# EAGLE design funnel (EAGLE 4.16)
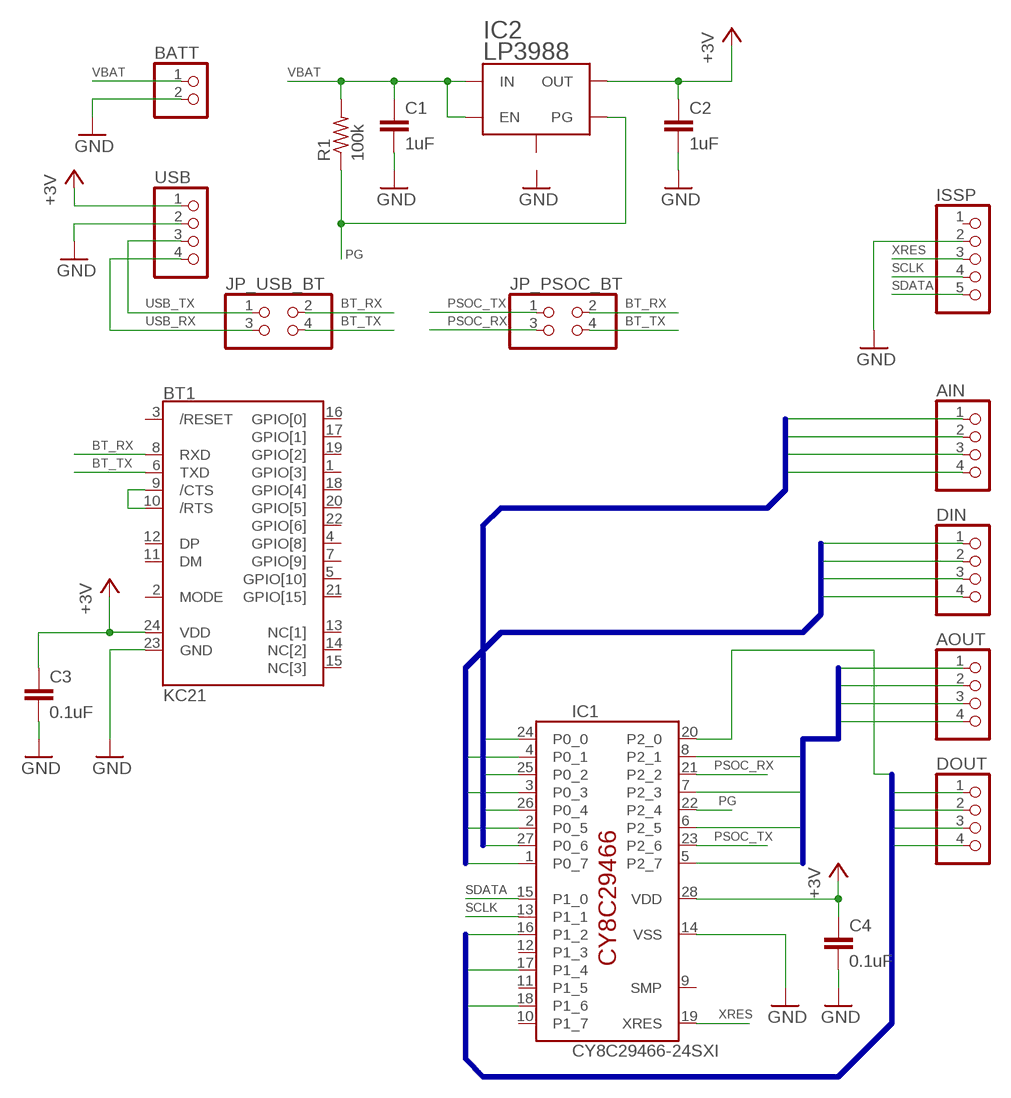
[diagram p0: schematic, sheet 1]

## Parts
AIN  PINHD-1X4  [1X04]
AOUT  PINHD-1X4  [1X04]
BATT  PINHD-1X2  [1X02]
BT1  KC21  [KC21]
C1  1uF  C-EUC3216  [C3216]
C2  1uF  C-EUC3216  [C3216]
C3  0.1uF  C-EUC2012  [C2012]
C4  0.1uF  C-EUC2012  [C2012]
DIN  PINHD-1X4  [1X04]
DOUT  PINHD-1X4  [1X04]
IC1  CY8C29466-24SXI  [SOIC28]
IC2  LP3988  [SOT-23-5]
ISSP  PINHD-1X5  [1X05]
JP_PSOC_BT  PINHD-2X2  [2X02]
JP_USB_BT  PINHD-2X2  [2X02]
R1  100k  R-US_R2012  [R2012]
USB  PINHD-1X4  [1X04]

## Nets
+3V: BT1.24(VDD) C2.1 C3.1 C4.1 IC1.28(VDD) IC2.P$5(OUT) USB.1
AIN0: AIN.1 IC1.27(P0_6)
AIN1: AIN.2 IC1.26(P0_4)
AIN2: AIN.3 IC1.25(P0_2)
AIN3: AIN.4 IC1.24(P0_0)
AOUT0: AOUT.1 IC1.5(P2_7)
AOUT1: AOUT.2 IC1.6(P2_5)
AOUT2: AOUT.3 IC1.7(P2_3)
AOUT3: AOUT.4 IC1.8(P2_1)
BT_RX: BT1.8(RXD) JP_PSOC_BT.2 JP_USB_BT.2
BT_TX: BT1.6(TXD) JP_PSOC_BT.4 JP_USB_BT.4
DIN0: DIN.1 IC1.1(P0_7)
DIN1: DIN.2 IC1.2(P0_5)
DIN2: DIN.3 IC1.3(P0_3)
DIN3: DIN.4 IC1.4(P0_1)
DOUT0: DOUT.1 IC1.18(P1_6)
DOUT1: DOUT.2 IC1.17(P1_4)
DOUT2: DOUT.3 IC1.16(P1_2)
DOUT3: DOUT.4 IC1.20(P2_0)
GND: BATT.2 BT1.23(GND) C1.2 C2.2 C3.2 C4.2 IC1.14(VSS) ISSP.2 USB.2
N$1: BT1.9(/CTS) BT1.10(/RTS)
PG: IC1.22(P2_4) IC2.P$4(PG) R1.1
PSOC_RX: IC1.21(P2_2) JP_PSOC_BT.3
PSOC_TX: IC1.23(P2_6) JP_PSOC_BT.1
SCLK: IC1.13(P1_1) ISSP.4
SDATA: IC1.15(P1_0) ISSP.5
USB_RX: JP_USB_BT.3 USB.4
USB_TX: JP_USB_BT.1 USB.3
VBAT: BATT.1 C1.1 IC2.P$1(IN) IC2.P$3(EN) R1.2
XRES: IC1.19(XRES) ISSP.3
Unconnected: BT1.1(GPIO[3]) BT1.2(MODE) BT1.3(/RESET) BT1.4(GPIO[8]) BT1.5(GPIO[10]) BT1.7(GPIO[9]) BT1.11(DM) BT1.12(DP) BT1.13(NC[1]) BT1.14(NC[2]) BT1.15(NC[3]) BT1.16(GPIO[0]) BT1.17(GPIO[1]) BT1.18(GPIO[4]) BT1.19(GPIO[2]) BT1.20(GPIO[5]) BT1.21(GPIO[15]) BT1.22(GPIO[6]) IC1.9(SMP) IC1.10(P1_7) IC1.11(P1_5) IC1.12(P1_3) ISSP.1

## Buses
AIN[0..3]
DIN[0..3]
AOUT[0..3]
DOUT[0..3]

## Power pins joined to a net without a drawn wire
GND: IC2.P$2(GND)

## Library data of the parts
AIN AOUT DIN DOUT USB = pinhead:PINHD-1X4: PIN HEADER
BATT = pinhead:PINHD-1X2: PIN HEADER
BT1 = kcwirefree_bluetooth:KC21
C1-C4 = rcl:C-EU: CAPACITOR, European symbol
IC1 = cypress_psoc:CY8C29466-24*: PSoC? Mixed-Signal Array CY8C29466-24PXI (DIP) CY8C29466-24SXI (SOIC) CY8C29466-24PVXI (SSOP)
IC2 = v-regulator_lp3988:LP3988
ISSP = pinhead:PINHD-1X5: PIN HEADER
JP_PSOC_BT JP_USB_BT = pinhead:PINHD-2X2: PIN HEADER
R1 = rcl:R-US_: RESISTOR, American symbol

## Board
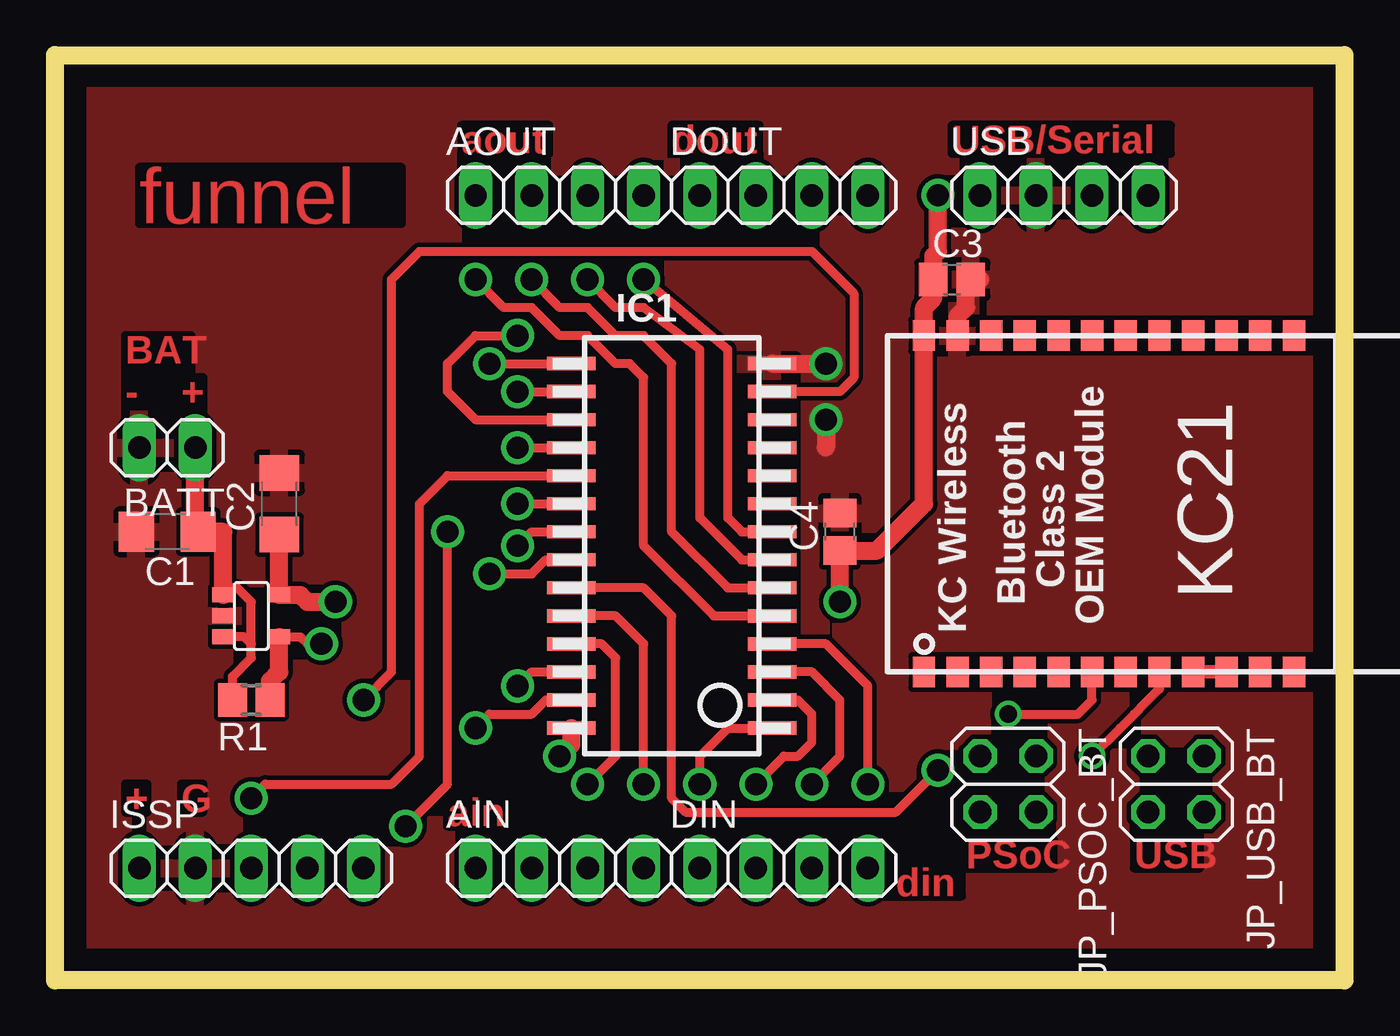
[diagram p1: board, top side]
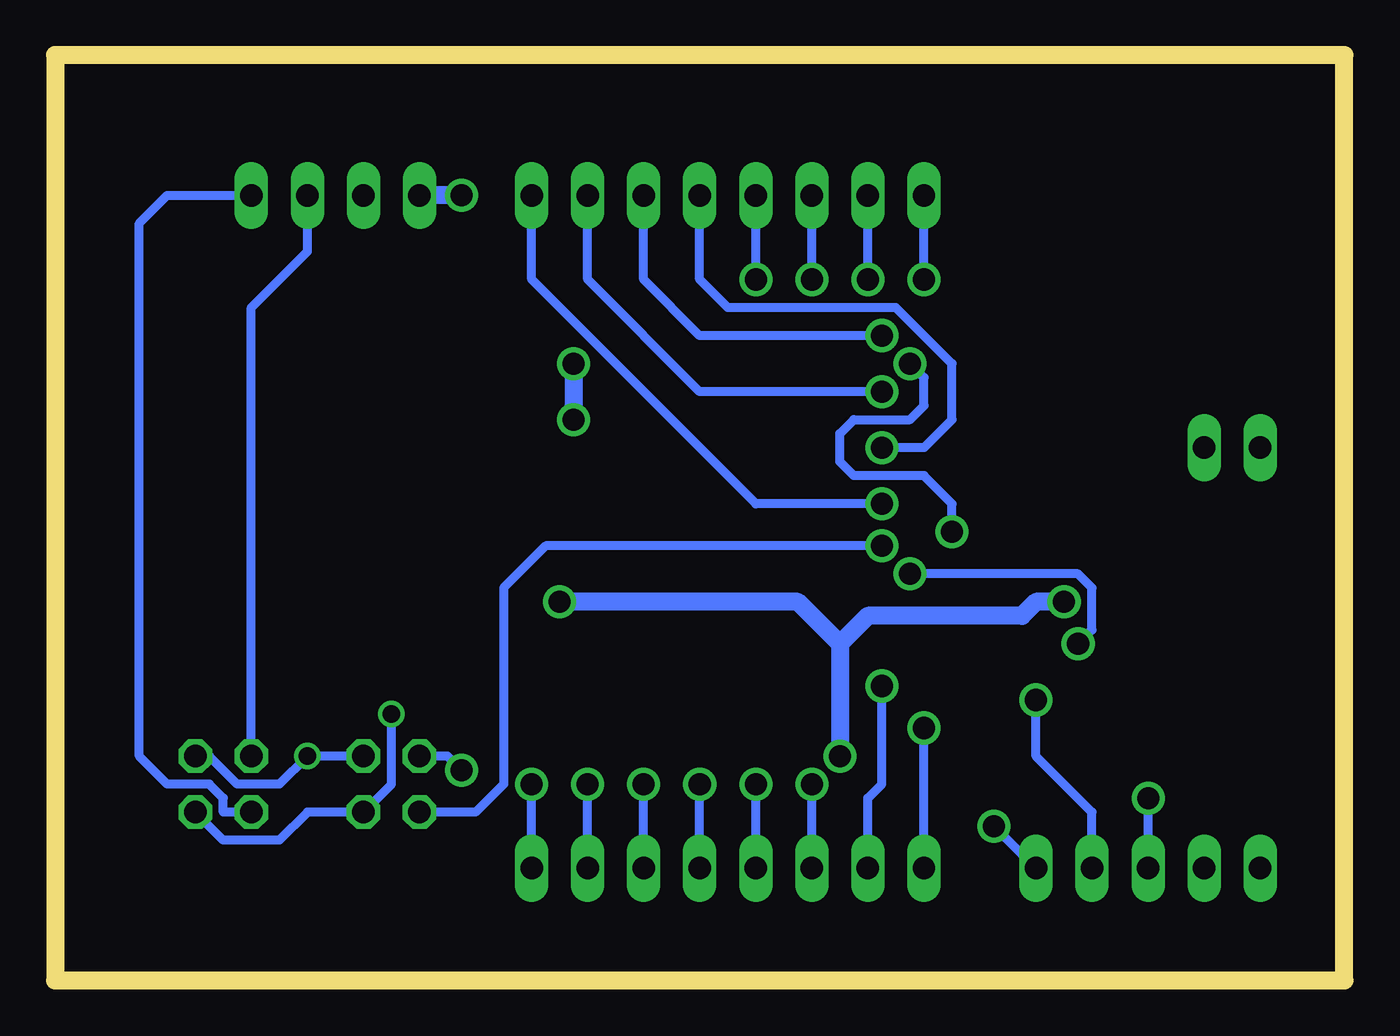
[diagram p2: board, bottom side, seen from below]

Size 58.42 x 41.91 mm. Coordinates in mm from the lower left corner, seen from the top.
Outline: 0,0 0,41.91 58.42,41.91 58.42,0 0,0
Copper layers (1*16): Top 0.035mm / dielectric 1.5mm / Bottom 0.035mm
Design rules "default": minimum track width 10mil, minimum drill 24mil, track to track 8mil, track to pad 8mil, pad to pad 8mil, via to via 8mil, smd to smd 8mil, copper to edge 40mil, drill to drill 8mil, minimum pad ring 10mil, minimum via ring 8mil, stop-mask expansion 4mil, vias tented up to drill 0mil, thermal gap 10mil

### Footprints (pad centres in the part's own frame; a part is rotated, then mirrored left to right if it is on the bottom)
1X04 = drill 1.016 long: 1 -3.81,0; 2 -1.27,0; 3 1.27,0; 4 3.81,0
1X02 = drill 1.016 long: 1 -1.27,0; 2 1.27,0
KC21 = smd 1.397 x 1.016: 1 0,0; 2 0,-1.524; 3 0,-3.048; 4 0,-4.572; 5 0,-6.096; 6 0,-7.62; 7 0,-9.144; 8 0,-10.668; 9 0,-12.192; 10 0,-13.716; 11 0,-15.24; 12 0,-16.764; 13 15.24,-16.764; 14 15.24,-15.24; 15 15.24,-13.716; 16 15.24,-12.192; 17 15.24,-10.668; 18 15.24,-9.144; 19 15.24,-7.62; 20 15.24,-6.096; 21 15.24,-4.572; 22 15.24,-3.048; 23 15.24,-1.524; 24 15.24,0
C3216 = smd 1.6 x 1.8: 1 -1.4,0; 2 1.4,0
C2012 = smd 1.3 x 1.5: 1 -0.85,0; 2 0.85,0
SOIC28 = smd 0.6 x 2.2: 1 8.89,4.548; 2 7.62,4.548; 3 6.35,4.548; 4 5.08,4.548; 5 3.81,4.548; 6 2.54,4.548; 7 1.27,4.548; 8 0,4.548; 9 -1.27,4.548; 10 -2.54,4.548; 11 -3.81,4.548; 12 -5.08,4.548; 13 -6.35,4.548; 14 -7.62,4.548; 15 -7.62,-4.548; 16 -6.35,-4.548; 17 -5.08,-4.548; 18 -3.81,-4.548; 19 -2.54,-4.548; 20 -1.27,-4.548; 21 0,-4.548; 22 1.27,-4.548; 23 2.54,-4.548; 24 3.81,-4.548; 25 5.08,-4.548; 26 6.35,-4.548; 27 7.62,-4.548; 28 8.89,-4.548
SOT-23-5 = smd 0.686 x 0.991: P$1 -0.953,-1.27; P$2 0,-1.27; P$3 0.953,-1.27; P$4 0.953,1.27; P$5 -0.953,1.27
1X05 = drill 1.016 long: 1 -5.08,0; 2 -2.54,0; 3 0,0; 4 2.54,0; 5 5.08,0
2X02 = drill 1.016 octagon: 1 -1.27,-1.27; 2 -1.27,1.27; 3 1.27,-1.27; 4 1.27,1.27
R2012 = smd 1.3 x 1.5: 1 -0.85,0; 2 0.85,0

### Placement (x,y rotation side)
AIN  22.86,5.08 0 top
AOUT  22.86,35.56 0 top
BATT  5.08,24.13 180 top
BT1  39.37,13.97 90 top
C1  5.08,20.32 180 top
C2  10.16,21.59 90 top
C3  40.64,31.75 0 top
C4  35.56,20.32 90 top
DIN  33.02,5.08 0 top
DOUT  33.02,35.56 0 top
IC1  27.94,20.32 270 top
IC2  8.89,16.51 270 top
ISSP  8.89,5.08 0 top
JP_PSOC_BT  43.18,8.89 270 top
JP_USB_BT  50.8,8.89 270 top
R1  8.89,12.7 180 top
USB  45.72,35.56 0 top

### Tracks (layer width: path | path; a pad name or v marks a point on that pad's centre or on a via)
+3V  (via drill 1)
  Top 0.813: 10.16,20.32 C2.1 IC2.P$5 11.11,17.46 11.43,17.14 v12.7,17.14 | IC1.28 23.39,10.69 v22.86,10.16 | v35.56,17.14 C4.1 37.25,19.47 39.37,21.59 BT1.24 39.37,30.48 39.79,30.9 C3.1 39.79,32.8 40.01,33.02 v40.01,35.56
  Bottom 0.813: 22.86,15.24 24.77,17.14 v35.56,17.14 | v40.01,35.56 USB.1 | 22.86,15.24 v22.86,10.16 | 22.86,15.24 21.59,16.51 14.61,16.51 13.97,17.14 v12.7,17.14
AIN0  (via drill 1)
  Top 0.406: IC1.27 22.22,12.7 21.59,12.07 19.68,12.07 v19.05,11.43
  Bottom 0.406: AIN.1 v19.05,11.43
AIN1  (via drill 1)
  Top 0.406: IC1.26 21.59,13.97 v20.95,13.34
  Bottom 0.406: v20.95,13.34 20.95,8.89 21.59,8.26 AIN.2
AIN2  (via drill 1)
  Top 0.406: IC1.25 24.77,15.24 25.4,14.61 25.4,10.16 v24.13,8.89
  Bottom 0.406: AIN.3 v24.13,8.89
AIN3  (via drill 1)
  Top 0.406: IC1.24 25.4,16.51 26.67,15.24 v26.67,8.89
  Bottom 0.406: AIN.4 v26.67,8.89
AOUT0  (via drill 1)
  Top 0.406: IC1.5 29.84,16.51 26.67,19.68 26.67,27.3 26.04,27.94 25.4,27.94 24.13,29.21 22.86,29.21 21.59,30.48 20.32,30.48 v19.05,31.75
  Bottom 0.406: v19.05,31.75 AOUT.1
AOUT1  (via drill 1)
  Top 0.406: IC1.6 30.48,17.78 27.94,20.32 27.94,27.94 26.67,29.21 25.4,29.21 24.13,30.48 22.86,30.48 v21.59,31.75
  Bottom 0.406: v21.59,31.75 AOUT.2
AOUT2  (via drill 1)
  Top 0.406: IC1.7 31.11,19.05 29.21,20.95 29.21,28.57 26.67,30.48 25.4,30.48 v24.13,31.75
  Bottom 0.406: v24.13,31.75 AOUT.3
AOUT3  (via drill 1)
  Top 0.406: IC1.8 31.11,20.32 30.48,20.95 30.48,28.57 v26.67,31.75
  Bottom 0.406: v26.67,31.75 AOUT.4
BT_RX  (via drill 0.8)
  Top 0.406: v46.99,10.16 48.26,11.43 | 48.26,11.43 48.9,12.07 | BT1.8 50.04,13.21 48.26,11.43
  Bottom 0.406: JP_PSOC_BT.2 v46.99,10.16 48.26,8.89 50.17,8.89 51.44,10.16 JP_USB_BT.2
BT_TX  (via drill 0.8)
  Top 0.406: v43.18,12.07 46.36,12.07 46.99,12.7 BT1.6
  Bottom 0.406: JP_USB_BT.4 50.8,6.35 48.26,6.35 46.99,7.62 JP_PSOC_BT.4 43.18,8.89 v43.18,12.07
DIN0  (via drill 1)
  Top 0.406: IC1.1 30.48,11.43 29.21,10.16 v29.21,8.89
  Bottom 0.406: DIN.1 v29.21,8.89
DIN1  (via drill 1)
  Top 0.406: IC1.2 33.66,12.7 34.29,12.07 34.29,10.79 33.66,10.16 33.02,10.16 v31.75,8.89
  Bottom 0.406: DIN.2 v31.75,8.89
DIN2  (via drill 1)
  Top 0.406: IC1.3 34.29,13.97 35.56,12.7 35.56,10.16 v34.29,8.89
  Bottom 0.406: DIN.3 v34.29,8.89
DIN3  (via drill 1)
  Top 0.406: IC1.4 34.93,15.24 36.83,13.34 v36.83,8.89
  Bottom 0.406: DIN.4 v36.83,8.89
DOUT0  (via drill 1)
  Top 0.406: v20.95,24.13 IC1.18 24.13,24.13
  Bottom 0.406: DOUT.1 29.21,31.75 27.94,30.48 20.32,30.48 17.78,27.94 17.78,25.4 19.05,24.13 v20.95,24.13
DOUT1  (via drill 1)
  Top 0.406: v20.95,29.21 19.05,29.21 17.78,27.94 17.78,26.67 19.05,25.4 IC1.17
  Bottom 0.406: DOUT.2 31.75,31.75 29.21,29.21 v20.95,29.21
DOUT2  (via drill 1)
  Top 0.406: v20.95,26.67 IC1.16
  Bottom 0.406: v20.95,26.67 29.21,26.67 34.29,31.75 DOUT.3
DOUT3  (via drill 1)
  Top 0.406: v20.95,21.59 IC1.20
  Bottom 0.406: v20.95,21.59 26.67,21.59 36.83,31.75 DOUT.4
GND  (via drill 1)
  Top 0.813: BT1.23 40.89,30.1 41.28,30.48 41.28,31.11 41.91,31.75 C3.2 | IC1.14 v34.93,27.94 | v34.93,25.4 34.93,24.13
  Bottom 0.813: v34.93,27.94 v34.93,25.4
  pour Top: -1.27,43.18 59.69,43.18 59.69,-1.27 -1.27,-1.27
N$1
  Top 0.61: BT1.9 BT1.10
PG  (via drill 1)
  Top 0.406: IC1.22 22.22,19.05 21.59,18.41 v19.68,18.41 | v12.06,15.24 11.43,15.24 11.11,15.56 IC2.P$4
  Top 0.813: R1.1 9.74,13.55 10.16,13.97 IC2.P$4
  Bottom 0.406: v19.68,18.41 12.06,18.41 11.43,17.78 11.43,15.88 v12.06,15.24
PSOC_RX  (via drill 1)
  Top 0.406: IC1.21 21.59,20.32 v20.95,19.68
  Bottom 0.406: v20.95,19.68 36.2,19.68 38.1,17.78 38.1,8.89 39.37,7.62 JP_PSOC_BT.3
PSOC_TX  (via drill 1)
  Top 0.406: IC1.23 26.67,17.78 27.94,16.51 27.94,8.26 28.57,7.62 38.1,7.62 v40.01,9.53
  Bottom 0.406: v40.01,9.53 40.64,10.16 JP_PSOC_BT.1
SCLK  (via drill 1)
  Top 0.406: IC1.13 35.56,26.67 36.2,27.3 36.2,31.11 34.29,33.02 16.51,33.02 15.24,31.75 15.24,13.97 v13.97,12.7
  Bottom 0.406: v13.97,12.7 13.97,10.16 11.43,7.62 ISSP.4
SDATA  (via drill 1)
  Top 0.406: v19.68,27.94 IC1.15 | v17.78,20.32 17.78,8.89 v15.88,6.98
  Bottom 0.406: v19.68,27.94 19.05,27.3 19.05,26.04 19.68,25.4 22.22,25.4 22.86,24.76 22.86,23.49 22.22,22.86 19.05,22.86 17.78,21.59 v17.78,20.32 | ISSP.5 v15.88,6.98
USB_RX
  Bottom 0.406: JP_USB_BT.3 50.8,7.62 50.8,8.26 51.44,8.89 53.34,8.89 54.61,10.16 54.61,34.29 53.34,35.56 USB.4
USB_TX
  Bottom 0.406: JP_USB_BT.1 49.53,30.48 46.99,33.02 USB.3
VBAT
  Top 0.406: 7.62,17.78 8.26,17.78 8.89,17.14 8.89,15.24 | 8.89,15.24 8.89,14.61 8.04,13.76 R1.2 | IC2.P$3 8.57,15.56 8.89,15.24
  Top 0.813: 6.35,20.32 BATT.1 | 6.35,20.32 C1.1 | 6.35,20.32 7.62,20.32 7.62,17.78 IC2.P$1
XRES  (via drill 1)
  Top 0.406: IC1.19 17.78,22.86 16.51,21.59 16.51,10.16 15.24,8.89 9.53,8.89 v8.89,8.26
  Bottom 0.406: ISSP.3 v8.89,8.26

### Text on the board
Top: aout | dout | USB/Serial | funnel | BAT | - | + | + | + | G | ain | PSoC | USB | din